# Altium project PCB_Project1.PrjPCB
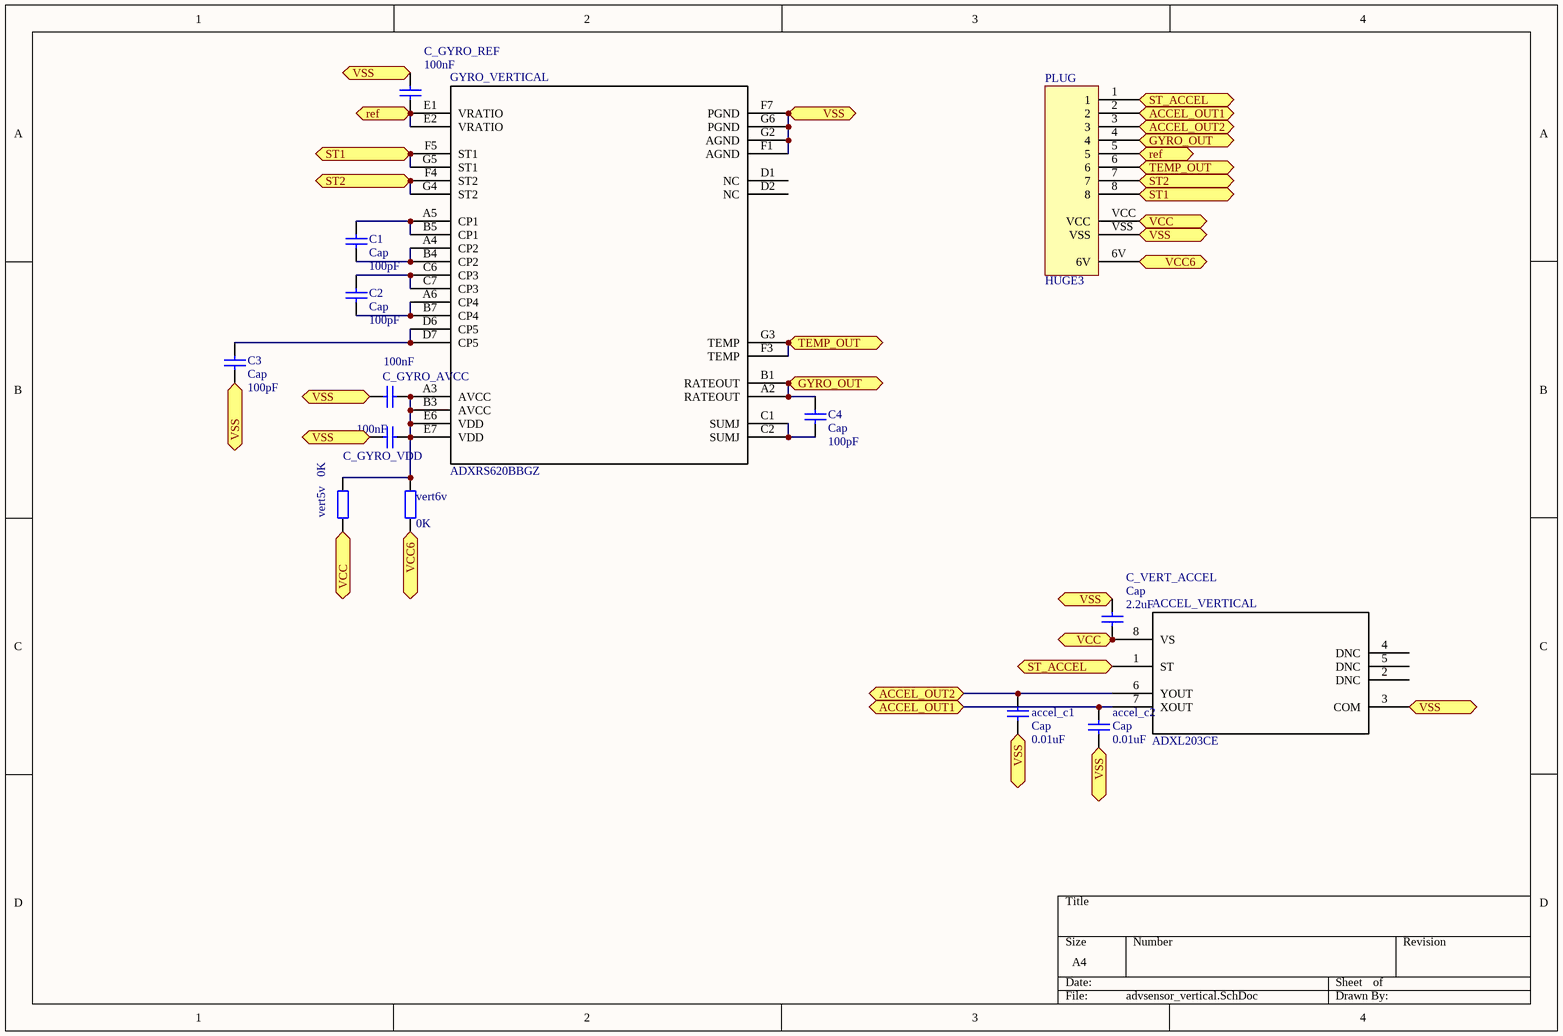
[diagram p0: advsensor_vertical.SchDoc]
4 sheets, 96 parts. Net scope: flat (ports and power ports of the same name join across sheets).
Board files: PMU.PcbDoc, advsensor.PcbDoc
Sheets:
  PMU.SchDoc
  advsensor_vertical.SchDoc
  advsensor_main.SchDoc
  power.SchDoc

## Sheet PMU.SchDoc
size A4

## Sheet advsensor_vertical.SchDoc
size A4

### Parts
accel_c1  Cap  value 0.01uF  [0805]
accel_c2  Cap  value 0.01uF  [0805]
ACCEL_VERTICAL  ADXL203CE  [ADXL203]
C1  Cap  value 100pF  [0805]
C2  Cap  value 100pF  [0805]
C3  Cap  value 100pF  [0805]
C4  Cap  value 100pF  [0805]
C_GYRO_AVCC  value 100nF  [0805]
C_GYRO_REF  value 100nF  [0805]
C_GYRO_VDD  value 100nF  [0805]
C_VERT_ACCEL  Cap  value 2.2uF  [0805]
GYRO_VERTICAL  ADXRS620BBGZ  [BG_32_3]
PLUG  HUGE3  [BIG]
vert5v  value 0K  [0603]
vert6v  value 0K  [0603]

### Ports
ACCEL_OUT1, ACCEL_OUT2, GYRO_OUT, ref, ST1, ST2, ST_ACCEL, TEMP_OUT, VCC, VCC6, VSS

### Nets
Netaccel_c1_1: accel_c1.1 accel_c2.1 ACCEL_VERTICAL.3(COM) C3.1 C_GYRO_AVCC.2 C_GYRO_REF.2 C_GYRO_VDD.2 C_VERT_ACCEL.2 GYRO_VERTICAL.F1(AGND) GYRO_VERTICAL.F7(PGND) GYRO_VERTICAL.G2(AGND) GYRO_VERTICAL.G6(PGND) PLUG.VSS ; port VSS
Netaccel_c1_2: accel_c1.2 ACCEL_VERTICAL.6(YOUT) PLUG.3 ; port ACCEL_OUT2
Netaccel_c2_2: accel_c2.2 ACCEL_VERTICAL.7(XOUT) PLUG.2 ; port ACCEL_OUT1
NetACCEL_VERTICAL_1: ACCEL_VERTICAL.1(ST) PLUG.1 ; port ST_ACCEL
NetACCEL_VERTICAL_8: ACCEL_VERTICAL.8(VS) C_VERT_ACCEL.1 PLUG.VCC vert5v.1 ; port VCC
NetC1_1: C1.1 GYRO_VERTICAL.A4(CP2) GYRO_VERTICAL.B4(CP2)
NetC1_2: C1.2 GYRO_VERTICAL.A5(CP1) GYRO_VERTICAL.B5(CP1)
NetC2_1: C2.1 GYRO_VERTICAL.A6(CP4) GYRO_VERTICAL.B7(CP4)
NetC2_2: C2.2 GYRO_VERTICAL.C6(CP3) GYRO_VERTICAL.C7(CP3)
NetC3_2: C3.2 GYRO_VERTICAL.D6(CP5) GYRO_VERTICAL.D7(CP5)
NetC4_1: C4.1 GYRO_VERTICAL.C1(SUMJ) GYRO_VERTICAL.C2(SUMJ)
NetC4_2: C4.2 GYRO_VERTICAL.A2(RATEOUT) GYRO_VERTICAL.B1(RATEOUT) PLUG.4 ; port GYRO_OUT
NetC_GYRO_AVCC_1: C_GYRO_AVCC.1 C_GYRO_VDD.1 GYRO_VERTICAL.A3(AVCC) GYRO_VERTICAL.B3(AVCC) GYRO_VERTICAL.E6(VDD) GYRO_VERTICAL.E7(VDD) vert5v.2 vert6v.1
NetC_GYRO_REF_1: C_GYRO_REF.1 GYRO_VERTICAL.E1(VRATIO) GYRO_VERTICAL.E2(VRATIO) PLUG.5 ; port ref
NetGYRO_VERTICAL_F3: GYRO_VERTICAL.F3(TEMP) GYRO_VERTICAL.G3(TEMP) PLUG.6 ; port TEMP_OUT
NetGYRO_VERTICAL_F4: GYRO_VERTICAL.F4(ST2) GYRO_VERTICAL.G4(ST2) PLUG.7 ; port ST2
NetGYRO_VERTICAL_F5: GYRO_VERTICAL.F5(ST1) GYRO_VERTICAL.G5(ST1) PLUG.8 ; port ST1
NetPLUG_6V: PLUG.6V vert6v.2 ; port VCC6

Not connected (* = marked no-connect by the designer): ACCEL_VERTICAL 2(DNC) 4(DNC) 5(DNC); GYRO_VERTICAL D1(NC) D2(NC)

### Library data of the parts
accel_c1 accel_c2 C1-C4 C_GYRO_AVCC C_GYRO_REF C_GYRO_VDD C_VERT_ACCEL = Cap: Capacitor; Published: 8-Jun-2000; LatestRevisionDate: 17-Jul-2002; LatestRevisionNote: Re-released for DXP Platform.; PackageReference: RAD-0.3; Publisher: Altium Limited; PackageDescription: Radial Cap, Thru-Hole; 2 Leads; 0.3 in Pin Spacing
ACCEL_VERTICAL = ADXL203CE: Imported; RefDes: RefDes; Type: DEV; Value: Value
GYRO_VERTICAL = ADXRS620BBGZ: Imported; Manufacturer_Part_Number: ADXRS613BBGZ; Vendor: Vendor; RefDes: RefDes; Type: DEV; Value: Value
vert5v vert6v = Res2: Resistor; Published: 8-Jun-2000; LatestRevisionDate: 17-Jul-2002; LatestRevisionNote: Re-released for DXP Platform.; PackageReference: AXIAL-0.4; Publisher: Altium Limited; PackageDescription: Axial Device, Thru-Hole; 2 Leads; 0.4 in Pin Spacing

## Sheet advsensor_main.SchDoc
size A3
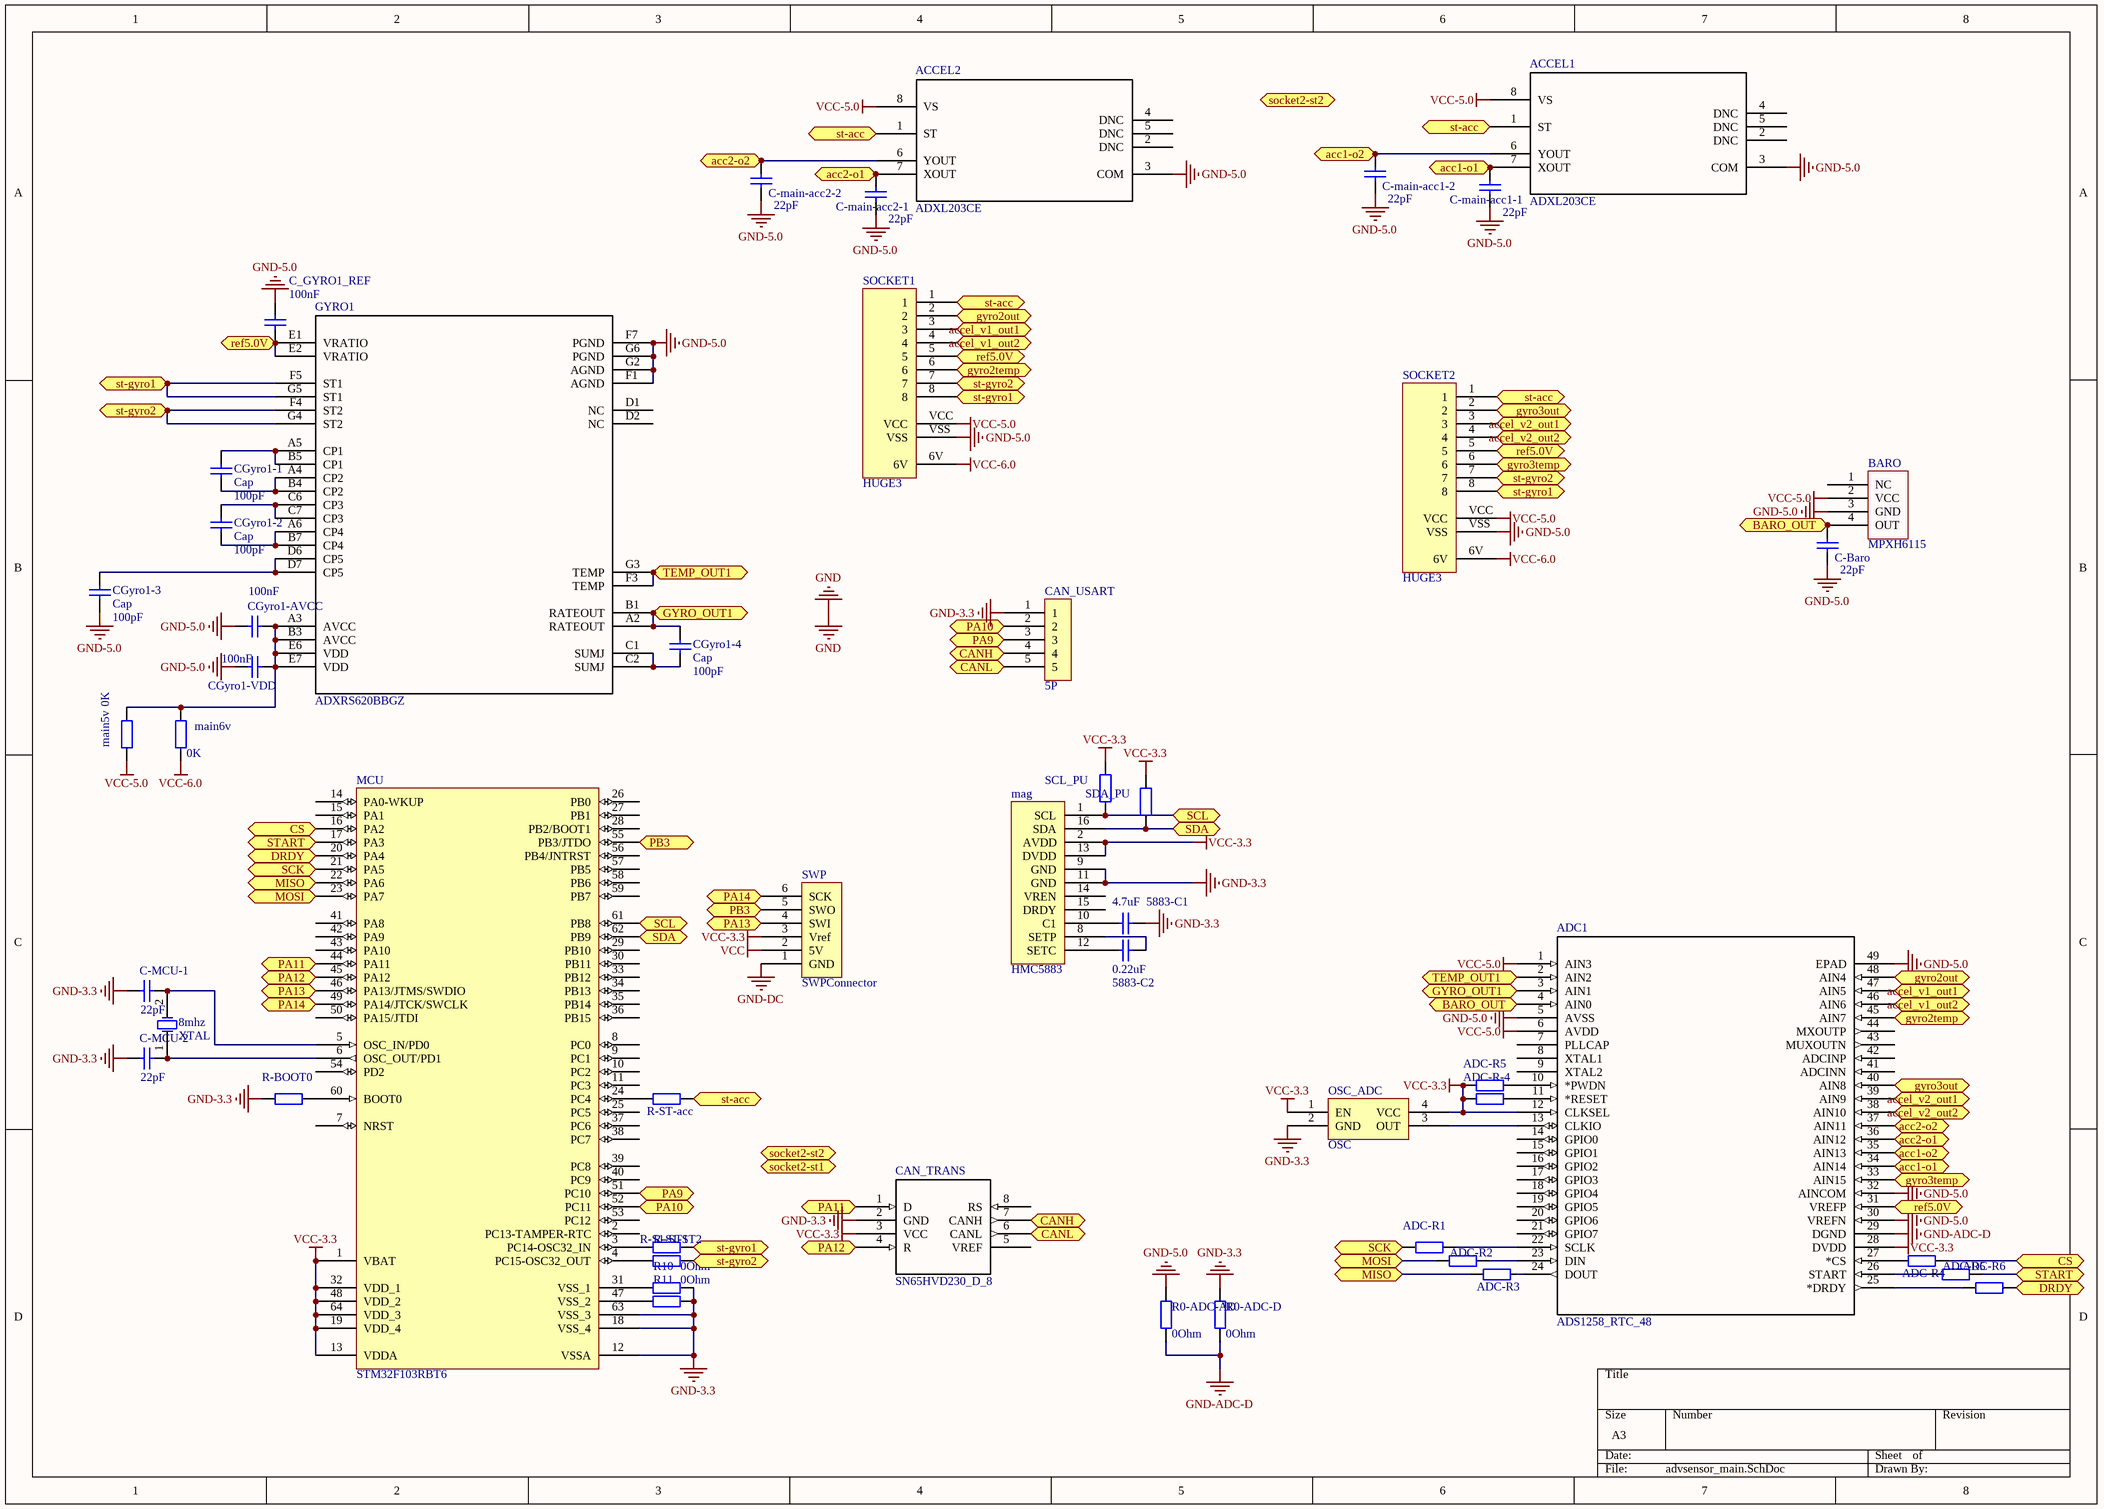
[diagram p1: advsensor_main.SchDoc]

### Parts
(Parts that share a designator on the sheet are numbered #1, #2 ... from top to bottom, then left to right.)
8mhz  XTAL  [5032]
5883-C1  value 4.7uF  [0603]
5883-C2  value 0.22uF  [0603]
ACCEL1  ADXL203CE  [ADXL203]
ACCEL2  ADXL203CE  [ADXL203]
ADC1  ADS1258_RTC_48  [RTC48_5P1X5P1 - weak]
ADC-R1  (no value)  [0603]
ADC-R2  (no value)  [0603]
ADC-R3  (no value)  [0603]
ADC-R4  (no value)  [0603]
ADC-R5#1  (no value)  [0603]
ADC-R5#2  (no value)  [0603]
ADC-R6  (no value)  [0603]
ADC-R-4  (no value)  [0603]
BARO  MPXH6115  [MPXH6115]
C-Baro  value 22pF  [0603]
C-main-acc1-1  value 22pF  [0603]
C-main-acc1-2  value 22pF  [0603]
C-main-acc2-1  value 22pF  [0603]
C-main-acc2-2  value 22pF  [0603]
C-MCU-1  value 22pF  [0603]
C-MCU-2  value 22pF  [0603]
C_GYRO1_REF  value 100nF  [0805]
CAN_TRANS  SN65HVD230_D_8  [D8]
CAN_USART  5P  [5P]
CGyro1-1  Cap  value 100pF  [0805]
CGyro1-2  Cap  value 100pF  [0805]
CGyro1-3  Cap  value 100pF  [0805]
CGyro1-4  Cap  value 100pF  [0805]
CGyro1-AVCC  value 100nF  [0805]
CGyro1-VDD  value 100nF  [0805]
GYRO1  ADXRS620BBGZ  [BG_32_3]
mag  HMC5883  [HMC5883]
main5v  value 0K  [0603]
main6v  value 0K  [0603]
MCU  STM32F103RBT6  [LQFP64_N]
OSC_ADC  OSC  [SMD4_5X32]
R0-ADC-AD  value 0Ohm  [0603]
R0-ADC-D  value 0Ohm  [0603]
R10  value 0Ohm  [0603]
R11  value 0Ohm  [0603]
R-BOOT0  (no value)  [0603]
R-S1-ST1  (no value)  [0603]
R-S1-ST2  (no value)  [0603]
R-ST-acc  (no value)  [0603]
SCL_PU  (no value)  [0603]
SDA_PU  (no value)  [0603]
SOCKET1  HUGE3  [BIG - socket2]
SOCKET2  HUGE3  [BIG - socket2]
SWP  SWPConnector  [SWPConnector]

### Ports
acc1-o1, acc1-o2, acc2-o1, acc2-o2, accel_v1_out1, accel_v1_out2, accel_v2_out1, accel_v2_out2, BARO_OUT, CANH, CANL, CS, DRDY, gyro2out, gyro2temp, gyro3out, gyro3temp, GYRO_OUT1, MISO, MOSI, PA9, PA10, PA11, PA12, PA13, PA14, PB3, ref5.0V, SCK, SCL, SDA, socket2-st1, socket2-st2, st-acc, st-gyro1, st-gyro2, START, TEMP_OUT1

### Nets
GND-3.3: 5883-C1.2 C-MCU-1.1 C-MCU-2.1 CAN_TRANS.2(GND) CAN_USART.1 mag.9(GND) mag.11(GND) MCU.12(VSSA) MCU.18(VSS_4) MCU.63(VSS_3) OSC_ADC.2(GND) R0-ADC-D.2 R10.2 R11.2 R-BOOT0.2
GND-5.0: ACCEL1.3(COM) ACCEL2.3(COM) ADC1.5(AVSS) ADC1.30(VREFN) ADC1.32(AINCOM) ADC1.49(EPAD) BARO.3(GND) C-Baro.1 C-main-acc1-1.1 C-main-acc1-2.1 C-main-acc2-1.1 C-main-acc2-2.1 C_GYRO1_REF.2 CGyro1-3.1 CGyro1-AVCC.2 CGyro1-VDD.2 GYRO1.F1(AGND) GYRO1.F7(PGND) GYRO1.G2(AGND) GYRO1.G6(PGND) R0-ADC-AD.2 SOCKET1.VSS SOCKET2.VSS
GND-ADC-D: ADC1.29(DGND) R0-ADC-AD.1 R0-ADC-D.1
GND-DC: SWP.1(GND)
VCC: SWP.2(5V)
VCC-3.3: ADC1.12(CLKSEL) ADC1.28(DVDD) ADC-R5#1.2 ADC-R-4.2 CAN_TRANS.3(VCC) mag.2(AVDD) mag.13(DVDD) MCU.1(VBAT) MCU.13(VDDA) MCU.19(VDD_4) MCU.32(VDD_1) MCU.48(VDD_2) MCU.64(VDD_3) OSC_ADC.1(EN) OSC_ADC.4(VCC) SCL_PU.1 SDA_PU.1 SWP.3(Vref)
VCC-5.0: ACCEL1.8(VS) ACCEL2.8(VS) ADC1.1(AIN3) ADC1.6(AVDD) BARO.2(VCC) main5v.1 SOCKET1.VCC SOCKET2.VCC
VCC-6.0: main6v.2 SOCKET1.6V SOCKET2.6V
Net8mhz_1: 8mhz.1(OSC1) C-MCU-2.2 MCU.6(OSC_OUT/PD1)
Net8mhz_2: 8mhz.2(OSC2) C-MCU-1.2 MCU.5(OSC_IN/PD0)
Net5883-C1_1: 5883-C1.1 mag.10(C1)
Net5883-C2_1: 5883-C2.1 mag.12(SETC)
Net5883-C2_2: 5883-C2.2 mag.8(SETP)
NetACCEL1_1: ACCEL1.1(ST) ACCEL2.1(ST) R-ST-acc.1 SOCKET1.1 SOCKET2.1 ; port st-acc
NetACCEL1_6: ACCEL1.6(YOUT) ADC1.35(AIN13) C-main-acc1-2.2 ; port acc1-o2
NetACCEL1_7: ACCEL1.7(XOUT) ADC1.34(AIN14) C-main-acc1-1.2 ; port acc1-o1
NetACCEL2_6: ACCEL2.6(YOUT) ADC1.37(AIN11) C-main-acc2-2.2 ; port acc2-o2
NetACCEL2_7: ACCEL2.7(XOUT) ADC1.36(AIN12) C-main-acc2-1.2 ; port acc2-o1
NetADC1_2: ADC1.2(AIN2) GYRO1.F3(TEMP) GYRO1.G3(TEMP) ; port TEMP_OUT1
NetADC1_3: ADC1.3(AIN1) CGyro1-4.2 GYRO1.A2(RATEOUT) GYRO1.B1(RATEOUT) ; port GYRO_OUT1
NetADC1_4: ADC1.4(AIN0) BARO.4(OUT) C-Baro.2 ; port BARO_OUT
NetADC1_10: ADC1.10(*PWDN) ADC-R5#1.1
NetADC1_11: ADC1.11(*RESET) ADC-R-4.1
NetADC1_13: ADC1.13(CLKIO) OSC_ADC.3(OUT)
NetADC1_22: ADC1.22(SCLK) ADC-R1.1
NetADC1_23: ADC1.23(DIN) ADC-R2.1
NetADC1_24: ADC1.24(DOUT) ADC-R3.1
NetADC1_25: ADC1.25(*DRDY) ADC-R6.2
NetADC1_26: ADC1.26(START) ADC-R5#2.2
NetADC1_27: ADC1.27(*CS) ADC-R4.2
NetADC1_31: ADC1.31(VREFP) C_GYRO1_REF.1 GYRO1.E1(VRATIO) GYRO1.E2(VRATIO) SOCKET1.5 SOCKET2.5 ; port ref5.0V
NetADC1_33: ADC1.33(AIN15) SOCKET2.6 ; port gyro3temp
NetADC1_38: ADC1.38(AIN10) SOCKET2.4 ; port accel_v2_out2
NetADC1_39: ADC1.39(AIN9) SOCKET2.3 ; port accel_v2_out1
NetADC1_40: ADC1.40(AIN8) SOCKET2.2 ; port gyro3out
NetADC1_45: ADC1.45(AIN7) SOCKET1.6 ; port gyro2temp
NetADC1_46: ADC1.46(AIN6) SOCKET1.4 ; port accel_v1_out2
NetADC1_47: ADC1.47(AIN5) SOCKET1.3 ; port accel_v1_out1
NetADC1_48: ADC1.48(AIN4) SOCKET1.2 ; port gyro2out
NetADC-R1_2: ADC-R1.2 MCU.21(PA5) ; port SCK
NetADC-R2_2: ADC-R2.2 MCU.23(PA7) ; port MOSI
NetADC-R3_2: ADC-R3.2 MCU.22(PA6) ; port MISO
NetADC-R4_1: ADC-R4.1 MCU.16(PA2) ; port CS
NetADC-R5#2_1: ADC-R5#2.1 MCU.17(PA3) ; port START
NetADC-R6_1: ADC-R6.1 MCU.20(PA4) ; port DRDY
NetCAN_TRANS_1: CAN_TRANS.1(D) MCU.44(PA11) ; port PA11
NetCAN_TRANS_4: CAN_TRANS.4(R) MCU.45(PA12) ; port PA12
NetCAN_TRANS_6: CAN_TRANS.6(CANL) CAN_USART.5 ; port CANL
NetCAN_TRANS_7: CAN_TRANS.7(CANH) CAN_USART.4 ; port CANH
NetCAN_USART_2: CAN_USART.2 MCU.52(PC11) ; port PA10
NetCAN_USART_3: CAN_USART.3 MCU.51(PC10) ; port PA9
NetCGyro1-1_1: CGyro1-1.1 GYRO1.A4(CP2) GYRO1.B4(CP2)
NetCGyro1-1_2: CGyro1-1.2 GYRO1.A5(CP1) GYRO1.B5(CP1)
NetCGyro1-2_1: CGyro1-2.1 GYRO1.A6(CP4) GYRO1.B7(CP4)
NetCGyro1-2_2: CGyro1-2.2 GYRO1.C6(CP3) GYRO1.C7(CP3)
NetCGyro1-3_2: CGyro1-3.2 GYRO1.D6(CP5) GYRO1.D7(CP5)
NetCGyro1-4_1: CGyro1-4.1 GYRO1.C1(SUMJ) GYRO1.C2(SUMJ)
NetCGyro1-AVCC_1: CGyro1-AVCC.1 CGyro1-VDD.1 GYRO1.A3(AVCC) GYRO1.B3(AVCC) GYRO1.E6(VDD) GYRO1.E7(VDD) main5v.2 main6v.1
NetGYRO1_F4: GYRO1.F4(ST2) GYRO1.G4(ST2) R-S1-ST1.1 SOCKET1.7 SOCKET2.7 ; port st-gyro2
NetGYRO1_F5: GYRO1.F5(ST1) GYRO1.G5(ST1) R-S1-ST2.1 SOCKET1.8 SOCKET2.8 ; port st-gyro1
Netmag_1: mag.1(SCL) MCU.61(PB8) SCL_PU.2 ; port SCL
Netmag_16: mag.16(SDA) MCU.62(PB9) SDA_PU.2 ; port SDA
NetMCU_3: MCU.3(PC14-OSC32_IN) R-S1-ST2.2
NetMCU_4: MCU.4(PC15-OSC32_OUT) R-S1-ST1.2
NetMCU_24: MCU.24(PC4) R-ST-acc.2
NetMCU_31: MCU.31(VSS_1) R10.1
NetMCU_46: MCU.46(PA13/JTMS/SWDIO) SWP.4(SWI) ; port PA13
NetMCU_47: MCU.47(VSS_2) R11.1
NetMCU_49: MCU.49(PA14/JTCK/SWCLK) SWP.6(SCK) ; port PA14
NetMCU_55: MCU.55(PB3/JTDO) SWP.5(SWO) ; port PB3
NetMCU_60: MCU.60(BOOT0) R-BOOT0.1

Not connected (* = marked no-connect by the designer): ACCEL1 2(DNC) 4(DNC) 5(DNC); ACCEL2 2(DNC) 4(DNC) 5(DNC); ADC1 7(PLLCAP) 8(XTAL1) 9(XTAL2) 14(GPIO0) 15(GPIO1) 16(GPIO2) 17(GPIO3) 18(GPIO4) 19(GPIO5) 20(GPIO6) 21(GPIO7) 41(ADCINN) 42(ADCINP) 43(MUXOUTN) 44(MXOUTP); BARO 1(NC); CAN_TRANS 5(VREF) 8(RS); GYRO1 D1(NC) D2(NC); mag 14(VREN) 15(DRDY); MCU 2(PC13-TAMPER-RTC) 7(NRST) 8(PC0) 9(PC1) 10(PC2) 11(PC3) 14(PA0-WKUP) 15(PA1) 25(PC5) 26(PB0) 27(PB1) 28(PB2/BOOT1) 29(PB10) 30(PB11) 33(PB12) 34(PB13) 35(PB14) 36(PB15) 37(PC6) 38(PC7) 39(PC8) 40(PC9) 41(PA8) 42(PA9) 43(PA10) 50(PA15/JTDI) 53(PC12) 54(PD2) 56(PB4/JNTRST) 57(PB5) 58(PB6) 59(PB7)

### Library data of the parts
8mhz = XTAL: Crystal Oscillator; Published: 8-Jun-2000; LatestRevisionDate: 17-Jul-2002; LatestRevisionNote: Re-released for DXP Platform.; PackageReference: R38; Publisher: Altium Limited; PackageDescription: Crystal, Thru-Hole; 2 Leads; Body 3.1 x 8.2 mm (Dia.xH)
5883-C1 5883-C2 = Cap Semi: Capacitor (Semiconductor SIM Model); Published: 8-Jun-2000; LatestRevisionDate: 29-May-2009; LatestRevisionNote: IPC-7351 Footprint Added.; PackageReference: C1206; Publisher: Altium Limited; PackageDescription: Chip Capacitor
ACCEL1 ACCEL2 = ADXL203CE: Imported; RefDes: RefDes; Type: DEV; Value: Value
ADC1 = ADS1258_RTC_48: Imported; Manufacturer: Texas Instruments; INDUSTRY_STD_PKG_TYPE: VQFN; FAMILY_NAME: PRECISION ADC (<=10MSPS); PIN_COUNT: 48; PACKAGE_DESIGNATOR: RTC; Datasheet URL: http://www.ti.com/lit/gpn/ADS1258; GENERIC_PART_NUMBER: ADS1258; RefDes: RefDes; Type: DEV; Value: Value
ADC-R1-ADC-R4 ADC-R5#1 ADC-R5#2 ADC-R6 ADC-R-4 main5v main6v R0-ADC-AD R0-ADC-D R10 R11 R-BOOT0 R-S1-ST1 R-S1-ST2 R-ST-acc SCL_PU SDA_PU = Res2: Resistor; Published: 8-Jun-2000; LatestRevisionDate: 17-Jul-2002; LatestRevisionNote: Re-released for DXP Platform.; PackageReference: AXIAL-0.4; Publisher: Altium Limited; PackageDescription: Axial Device, Thru-Hole; 2 Leads; 0.4 in Pin Spacing
C-Baro C-main-acc1-1 C-main-acc1-2 C-main-acc2-1 C-main-acc2-2 C-MCU-1 C-MCU-2 C_GYRO1_REF CGyro1-1-CGyro1-4 CGyro1-AVCC CGyro1-VDD = Cap: Capacitor; Published: 8-Jun-2000; LatestRevisionDate: 17-Jul-2002; LatestRevisionNote: Re-released for DXP Platform.; PackageReference: RAD-0.3; Publisher: Altium Limited; PackageDescription: Radial Cap, Thru-Hole; 2 Leads; 0.3 in Pin Spacing
CAN_TRANS = SN65HVD230_D_8: Imported; Manufacturer: Texas Instruments; INDUSTRY_STD_PKG_TYPE: SOIC; FAMILY_NAME: CAN; PIN_COUNT: 8; PACKAGE_DESIGNATOR: D; Datasheet URL: http://www.ti.com/lit/gpn/SN65HVD230; GENERIC_PART_NUMBER: SN65HVD230; Vendor: Texas Instruments; Manufacturer_Part_Number: sn65hvd230_d_8; RefDes: RefDes; Type: DEV; Value: Value
GYRO1 = ADXRS620BBGZ: as GYRO_VERTICAL on sheet advsensor_vertical; Vendor: Vendor; RefDes: RefDes; Type: DEV; Value: Value
MCU = STM32F103RBT6: STM32 ARM-based 32-bit MCU with 128 Kbytes Flash, 64-pin LQFP, Industrial Temperature; Published: *; DatasheetVersion: *; PackageVersion: *; PackageReference: *; Publisher: *; PackageDescription: *; ComponentLink1Description: *; ComponentLink1URL: *; ComponentLink2Description: *; ComponentLink2URL: *

## Sheet power.SchDoc
size A4
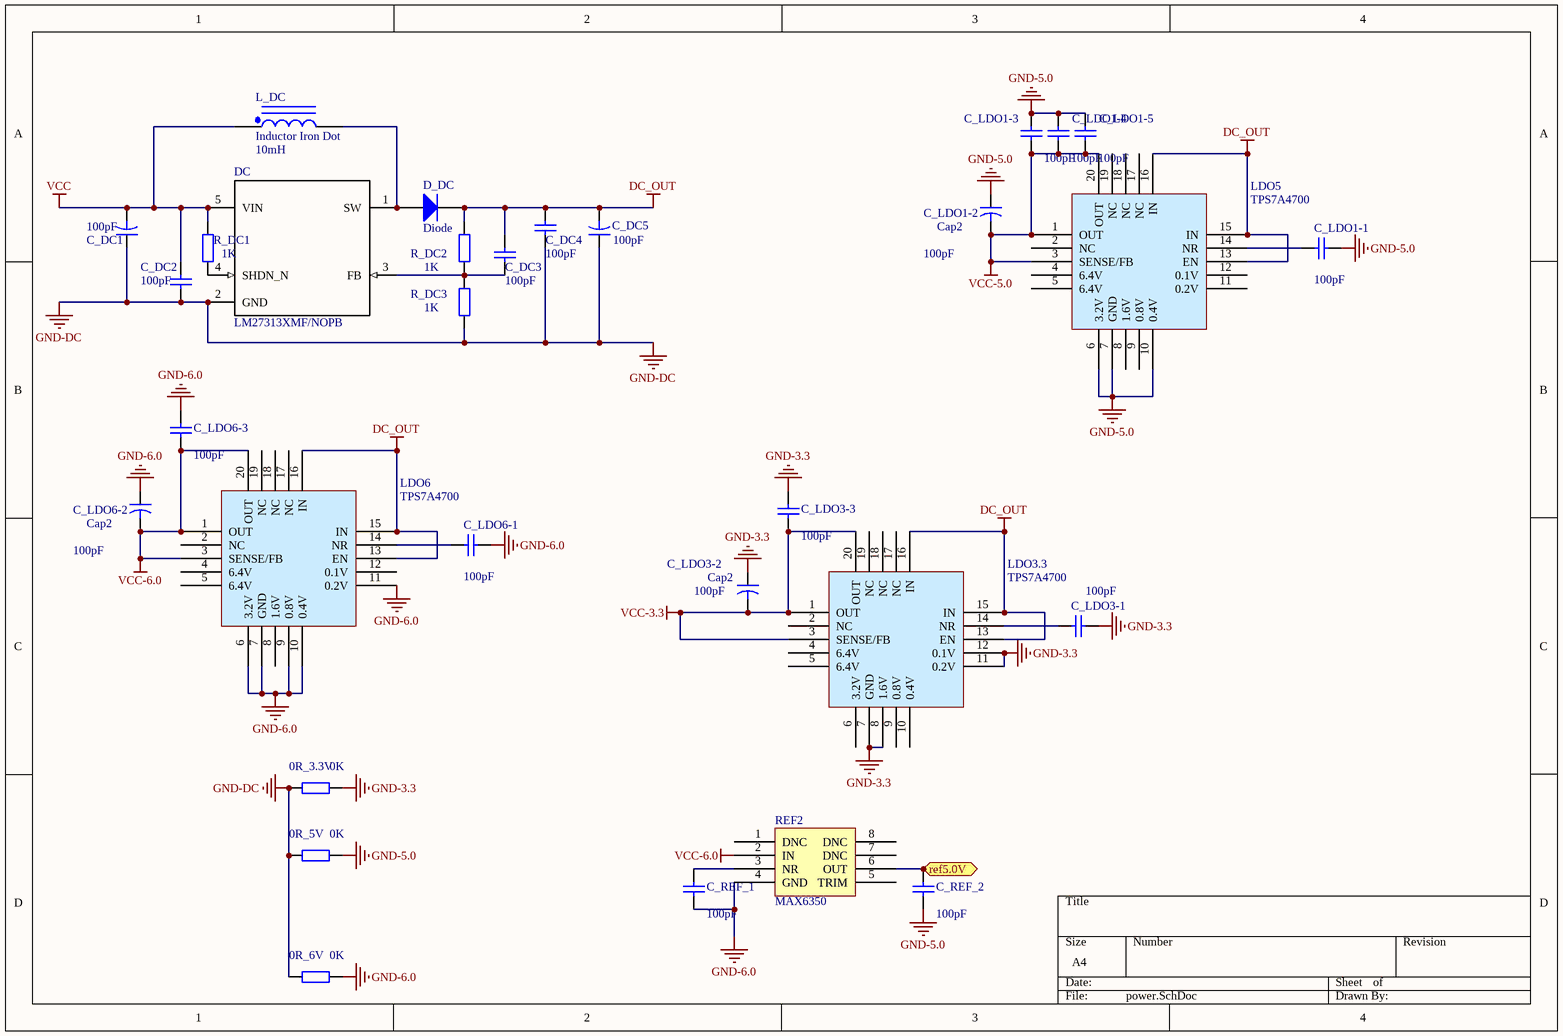
[diagram p2: power.SchDoc]

### Parts
0R_3.3V  value 0K  [0603 - no]
0R_5V  value 0K  [0603 - no]
0R_6V  value 0K  [0603 - no]
C_DC1  value 100pF  [1210]
C_DC2  value 100pF  [0603 - no]
C_DC3  value 100pF  [0603 - no]
C_DC4  value 100pF  [0805]
C_DC5  value 100pF  [1210]
C_LDO1-1  value 100pF  [0603 - no]
C_LDO1-2  Cap2  value 100pF  [1210]
C_LDO1-3  value 100pF  [0805]
C_LDO1-4  value 100pF  [0805]
C_LDO1-5  value 100pF  [0805]
C_LDO3-1  value 100pF  [0603 - no]
C_LDO3-2  Cap2  value 100pF  [1210]
C_LDO3-3  value 100pF  [0805]
C_LDO6-1  value 100pF  [0603 - no]
C_LDO6-2  Cap2  value 100pF  [1210]
C_LDO6-3  value 100pF  [0805]
C_REF_1  value 100pF  [0603 - no]
C_REF_2  value 100pF  [0603 - no]
D_DC  Diode  [Diode-SOD123]
DC  LM27313XMF/NOPB  [DBV0005A]
L_DC  Inductor Iron Dot  value 10mH  [GDNR5040]
LDO3.3  TPS7A4700  [TPS7A4700 - b]
LDO5  TPS7A4700  [TPS7A4700 - b]
LDO6  TPS7A4700  [TPS7A4700 - b]
R_DC1  value 1K  [0603 - no]
R_DC2  value 1K  [0603 - no]
R_DC3  value 1K  [0603 - no]
REF2  MAX6350  [D8]

### Ports
ref5.0V

### Nets
DC_OUT: C_DC3.2 C_DC4.2 C_DC5.2 D_DC.2(K) LDO3.3.13(EN) LDO3.3.15(IN) LDO3.3.16(IN) LDO5.13(EN) LDO5.15(IN) LDO5.16(IN) LDO6.13(EN) LDO6.15(IN) LDO6.16(IN) R_DC2.2
GND-3.3: 0R_3.3V.1 C_LDO3-1.1 C_LDO3-2.1 C_LDO3-3.1 LDO3.3.7(GND) LDO3.3.8(1.6V) LDO3.3.11(0.2V) LDO3.3.12(0.1V)
GND-5.0: 0R_5V.1 C_LDO1-1.1 C_LDO1-2.1 C_LDO1-3.1 C_LDO1-4.1 C_LDO1-5.1 C_REF_2.2 LDO5.6(3.2V) LDO5.7(GND) LDO5.10(0.4V)
GND-6.0: 0R_6V.1 C_LDO6-1.1 C_LDO6-2.1 C_LDO6-3.1 C_REF_1.2 LDO6.6(3.2V) LDO6.7(GND) LDO6.9(0.8V) LDO6.10(0.4V) LDO6.11(0.2V) REF2.4(GND)
GND-DC: 0R_3.3V.2 0R_5V.2 0R_6V.2 C_DC1.1 C_DC2.1 C_DC4.1 C_DC5.1 DC.2(GND) R_DC3.1
VCC: C_DC1.2 C_DC2.2 DC.5(VIN) L_DC.1 R_DC1.2
VCC-3.3: C_LDO3-2.2 C_LDO3-3.2 LDO3.3.1(OUT) LDO3.3.3(SENSE/FB) LDO3.3.20(OUT)
VCC-5.0: C_LDO1-2.2 C_LDO1-3.2 C_LDO1-4.2 C_LDO1-5.2 LDO5.1(OUT) LDO5.3(SENSE/FB) LDO5.20(OUT)
VCC-6.0: C_LDO6-2.2 C_LDO6-3.2 LDO6.1(OUT) LDO6.3(SENSE/FB) LDO6.20(OUT) REF2.2(IN)
NetADC1_31: C_REF_2.1 REF2.6(OUT) ; port ref5.0V
NetC_DC3_1: C_DC3.1 DC.3(FB) R_DC2.1 R_DC3.2
NetC_LDO1-1_2: C_LDO1-1.2 LDO5.14(NR)
NetC_LDO3-1_2: C_LDO3-1.2 LDO3.3.14(NR)
NetC_LDO6-1_2: C_LDO6-1.2 LDO6.14(NR)
NetC_REF_1_1: C_REF_1.1 REF2.3(NR)
NetD_DC_1: D_DC.1(A) DC.1(SW) L_DC.2
NetDC_4: DC.4(SHDN_N) R_DC1.1

Not connected (* = marked no-connect by the designer): LDO3.3 2(NC) 4(6.4V) 5(6.4V) 6(3.2V) 9(0.8V) 10(0.4V) 17(NC) 18(NC) 19(NC); LDO5 2(NC) 4(6.4V) 5(6.4V) 8(1.6V) 9(0.8V) 11(0.2V) 12(0.1V) 17(NC) 18(NC) 19(NC); LDO6 2(NC) 4(6.4V) 5(6.4V) 8(1.6V) 12(0.1V) 17(NC) 18(NC) 19(NC); REF2 1(DNC) 5(TRIM) 7(DNC) 8(DNC)

### Library data of the parts
0R_3.3V 0R_5V 0R_6V R_DC1-R_DC3 = Res2: Resistor; Published: 8-Jun-2000; LatestRevisionDate: 17-Jul-2002; LatestRevisionNote: Re-released for DXP Platform.; PackageReference: AXIAL-0.4; Publisher: Altium Limited; PackageDescription: Axial Device, Thru-Hole; 2 Leads; 0.4 in Pin Spacing
C_DC1 C_DC5 C_LDO1-2 C_LDO3-2 C_LDO6-2 = Cap2: Capacitor; Published: 23-Sep-2002; PackageReference: CAPR5-4X5; Publisher: Altium Limited; PackageDescription: Capacitor; 2 Leads
C_DC2-C_DC4 C_LDO1-1 C_LDO1-3-C_LDO1-5 C_LDO3-1 C_LDO3-3 C_LDO6-1 C_LDO6-3 C_REF_1 C_REF_2 = Cap: Capacitor; Published: 8-Jun-2000; LatestRevisionDate: 17-Jul-2002; LatestRevisionNote: Re-released for DXP Platform.; PackageReference: RAD-0.3; Publisher: Altium Limited; PackageDescription: Radial Cap, Thru-Hole; 2 Leads; 0.3 in Pin Spacing
D_DC = Diode: Default Diode; Published: 8-Jun-2000; LatestRevisionDate: 17-Jul-2002; LatestRevisionNote: Re-released for DXP Platform.; PackageVersion: Sep-1996; PackageReference: SMC; Publisher: Altium Limited; PackageDescription: DO-214-AB/SMC; 2 C-Bend Leads; Body 7.9 x 5.9 mm, inc. leads (LxW); Code_JEDEC: DO-214-AB
DC = LM27313XMF/NOPB: Imported; Manufacturer: Texas Instruments; CompType: IC; PIN_COUNT: 5; PartNumber: LM27313XMF/NOPB; PackageReference: DBV0005A; MountType: SMT; RoHS: Y; RefDes: RefDes; Type: DEV; Value: Value
L_DC = Inductor Iron Dot: Magnetic-Core Inductor with Winding Polarity Marking; Published: 24-Mar-1999; LatestRevisionDate: 17-Jul-2002; LatestRevisionNote: Re-released for DXP Platform.; PackageReference: DIODE_SMC; Publisher: Altium Limited; PackageDescription: Diode; 2 Leads

## Nets that join several sheets
GND-3.3: advsensor_main (15 pins), power (8 pins)
GND-5.0: advsensor_main (23 pins), power (10 pins)
GND-DC: advsensor_main (SWP.1), power (9 pins)
VCC: advsensor_main (SWP.2), power (5 pins)
VCC-3.3: advsensor_main (18 pins), power (5 pins)
VCC-5.0: advsensor_main (8 pins), power (7 pins)
VCC-6.0: advsensor_main (main6v.2 SOCKET1.6V SOCKET2.6V), power (6 pins)
NetADC1_31: advsensor_main (6 pins), power (C_REF_2.1 REF2.6)